# Altium schematic sheet Sheet1.SchDoc
size A4
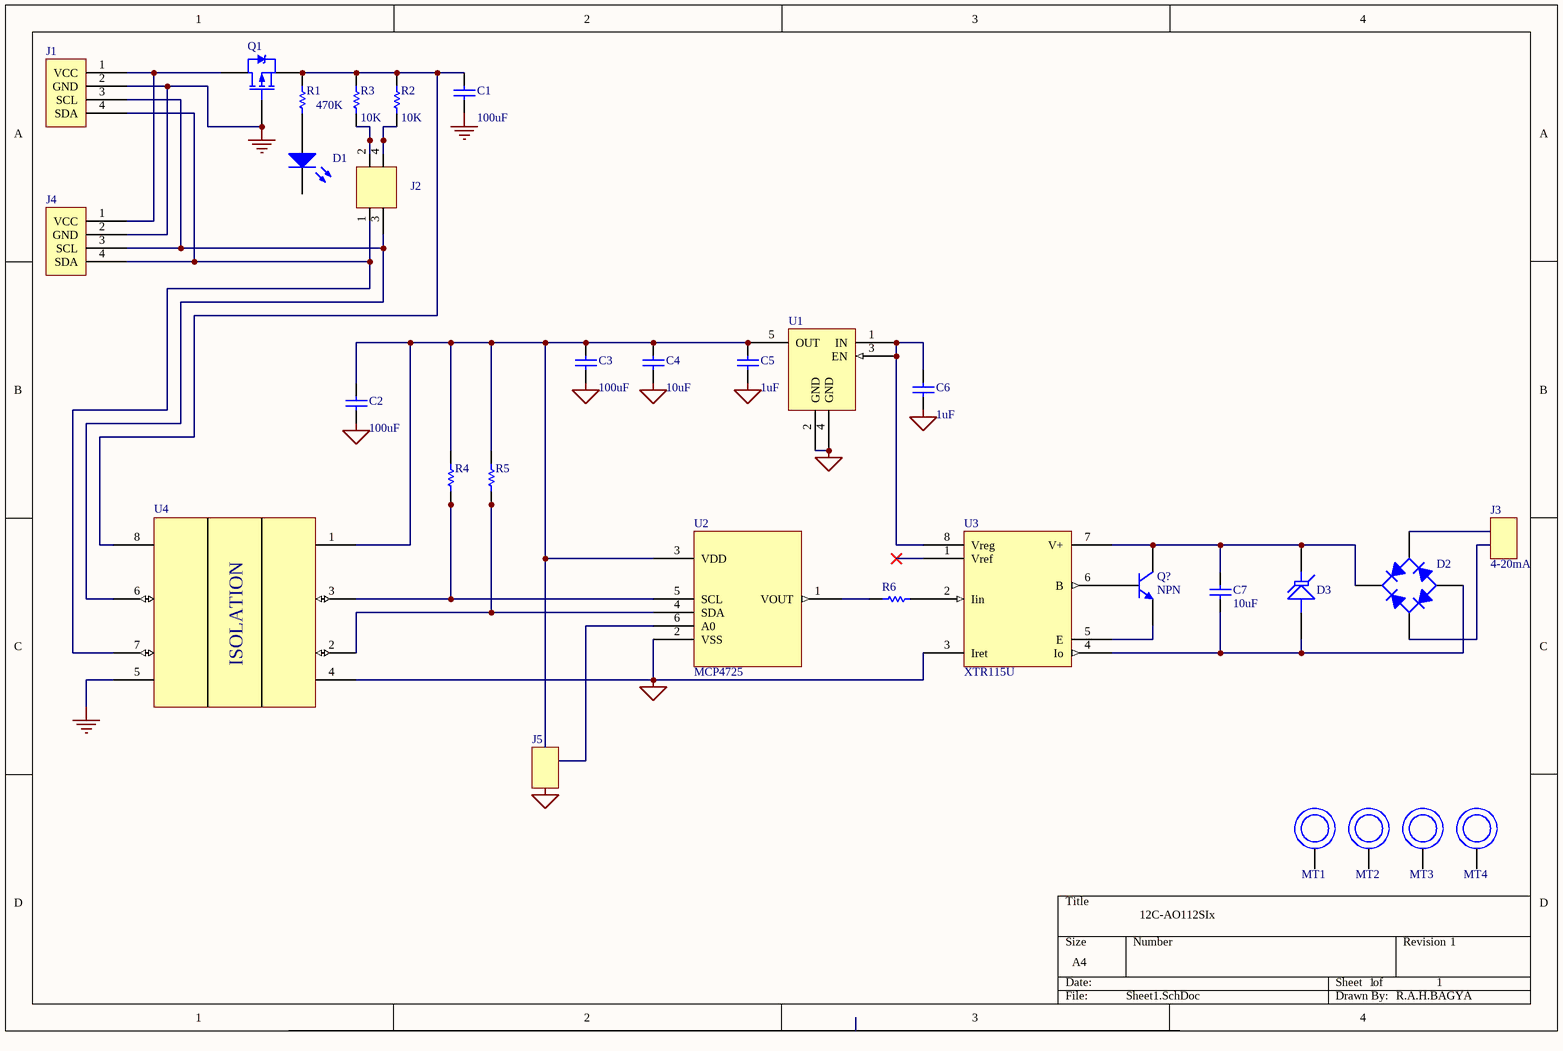
[diagram p0: Sheet1.SchDoc]

## Parts
C1  value 100uF  [RAD-0.3]  (hidden comment: Cap)
C2  value 100uF  [RAD-0.3]  (hidden comment: Cap)
C3  value 100uF  [RAD-0.3]  (hidden comment: Cap)
C4  value 10uF  [RAD-0.3]  (hidden comment: Cap)
C5  value 1uF  [RAD-0.3]  (hidden comment: Cap)
C6  value 1uF  [RAD-0.3]  (hidden comment: Cap)
C7  value 10uF  [RAD-0.3]  (hidden comment: Cap)
D1  LED1  [LED-1]  (value not drawn)
D2  Bridge1  [D-38]  (value not drawn)
D3  Tranzorb  [DO-7]  (value not drawn)
J1  (no value)
J2  Component_1  (value not drawn)
J3  4-20mA
J4  (no value)
J5  Component_1  (value not drawn)
MT1  Component_1  (value not drawn)
MT2  (no value)
MT3  (no value)
MT4  (no value)
Q1  PMOS-2  [TO-220AB]  (value not drawn)
Q?  NPN  [TO-226-AA]
R1  value 470K  [AXIAL-0.3]  (hidden comment: Res1)
R2  value 10K  [AXIAL-0.3]  (hidden comment: Res1)
R3  value 10K  [AXIAL-0.3]  (hidden comment: Res1)
R4  Res1  [AXIAL-0.3]  (value not drawn)
R5  Res1  [AXIAL-0.3]  (value not drawn)
R6  Res1  [AXIAL-0.3]  (value not drawn)
U1  U1  (value not drawn)
U2  MCP4725
U3  XTR115U
U4  (no value)

## Nets
GND: C1.1 C2.1 C3.1 C4.1 C5.1 C6.1 J1.2(GND) J4.2(GND) Q1.1(G) U1.2(GND) U1.4(GND) U2.2(VSS) U3.3(Iret) U4.4 U4.5
NetC1_2: C1.2 Q1.3(S) R1.2 R2.2 R3.2 U4.8
NetC2_2: C2.2 C3.2 C4.2 C5.2 R4.2 R5.2 U1.5(OUT) U2.3(VDD) U4.1
NetC6_2: C6.2 U1.1(IN) U1.3(EN) U3.8(Vreg)
NetC7_1: C7.1 D2.1(K) D3.2(K) Q?.1(C) U3.7(V+)
NetC7_2: C7.2 D2.3(A) D3.1(A) U3.4(Io)
NetD1_1: D1.1(A) R1.1
NetJ1_1: J1.1(VCC) J4.1(VCC) Q1.2(D)
NetJ1_3: J1.3(SCL) J4.3(SCL) U4.6
NetJ1_4: J1.4(SDA) J4.4(SDA) U4.7
NetJ2_2: J2.2 R3.1
NetJ2_4: J2.4 R2.1
NetQ?_2: Q?.2(B) U3.6(B)
NetQ?_3: Q?.3(E) U3.5(E)
NetR4_1: R4.1 U2.5(SCL) U4.3
NetR5_1: R5.1 U2.4(SDA) U4.2
NetR6_1: R6.1 U2.1(VOUT)
NetR6_2: R6.2 U3.2(Iin)

Not connected (* = marked no-connect by the designer): D1 2(K); D2 2(C) 4(C); J2 1(9) 3(10); MT1 ?1; MT2 ?1; MT3 ?1; MT4 ?1; U2 6(A0); U3 1(Vref)*

## Notes on the sheet
- 12C-AO112SIx
- 1
- R.A.H.BAGYA
- Labels drawn without touching a wire or pin: GND
- (in symbol Component_1) ISOLATION

## Library data of the parts
C1-C7 = Cap: Capacitor; Published: 8-Jun-2000; LatestRevisionDate: 17-Jul-2002; LatestRevisionNote: Re-released for DXP Platform.; PackageReference: RAD-0.3; Publisher: Altium Limited; PackageDescription: Radial Cap, Thru-Hole; 2 Leads; 0.3 in Pin Spacing
D1 = LED1: Typical RED GaAs LED; Published: 8-Jun-2000; LatestRevisionDate: 08-Jul-2005; LatestRevisionNote: Mech Layer 1 removed.; PackageReference: LED-1; Publisher: Altium Limited; PackageDescription: LED; 2 Leads
D2 = Bridge1: Full Wave Diode Bridge; Published: 8-Jun-2000; LatestRevisionDate: 29-May-2009; LatestRevisionNote: Sch pins A & K swapped.; DatasheetVersion: E2732B; PackageReference: D-38; Publisher: Altium Limited; PackageDescription: Bridge Rectifier; 4 Terminals; Body 9.4 x 9.4 mm (typ); Pitch 5.08 mm
D3 = Tranzorb: Transient Voltage Suppression (TVS) Diode; Published: 24-Mar-1999; LatestRevisionDate: 17-Jul-2002; LatestRevisionNote: Re-released for DXP Platform.; PackageReference: DO-7; Publisher: Altium Limited; PackageDescription: Axial Lead Diode
J1 J3 J4 MT2-MT4 U1-U4 = Component_1
Q1 = PMOS-2: P-Channel Power MOSFET; Note: Pin 4 not drawn and electrically connected to Pin 2.; Published: 8-Jun-2000; LatestRevisionDate: 17-Jul-2002; LatestRevisionNote: Re-released for DXP Platform.; DatasheetVersion: PD-9.390D; PackageVersion: Feb-1997; PackageReference: TO-220AB; Publisher: Altium Limited; PackageDescription: TO, Thru-Hole, Vertical, Heatsink Mounted; 3 In-Line Leads; Pitch 2.54 mm; ComponentLink1Description: Manufacturer Link; ComponentLink1URL: http://www.irf.com/
Q? = NPN: NPN Bipolar Transistor; Published: 8-Jun-2000; LatestRevisionDate: 17-Jul-2002; LatestRevisionNote: Re-released for DXP Platform.; PackageReference: TO-226-AA; Publisher: Altium Limited; PackageDescription: TO, Flat Index; 3 In-Line, Axial Leads; Body Dia. 4.8mm; Leads 0.55 x 0.51 mm (max); Code_JEDEC: TO-226-AA
R1-R3 = Res1: Resistor; Published: 8-Jun-2000; LatestRevisionDate: 17-Jul-2002; LatestRevisionNote: Re-released for DXP Platform.; PackageReference: AXIAL-0.3; Publisher: Altium Limited; PackageDescription: Axial Device, Thru-Hole; 2 Leads; 0.3 in Pin Spacing
R4-R6 = Res1: Resistor; Value: 1K; Published: 8-Jun-2000; LatestRevisionDate: 17-Jul-2002; LatestRevisionNote: Re-released for DXP Platform.; PackageReference: AXIAL-0.3; Publisher: Altium Limited; PackageDescription: Axial Device, Thru-Hole; 2 Leads; 0.3 in Pin Spacing